# EAGLE schematic comunicazione seriale (EAGLE 8.0.0)
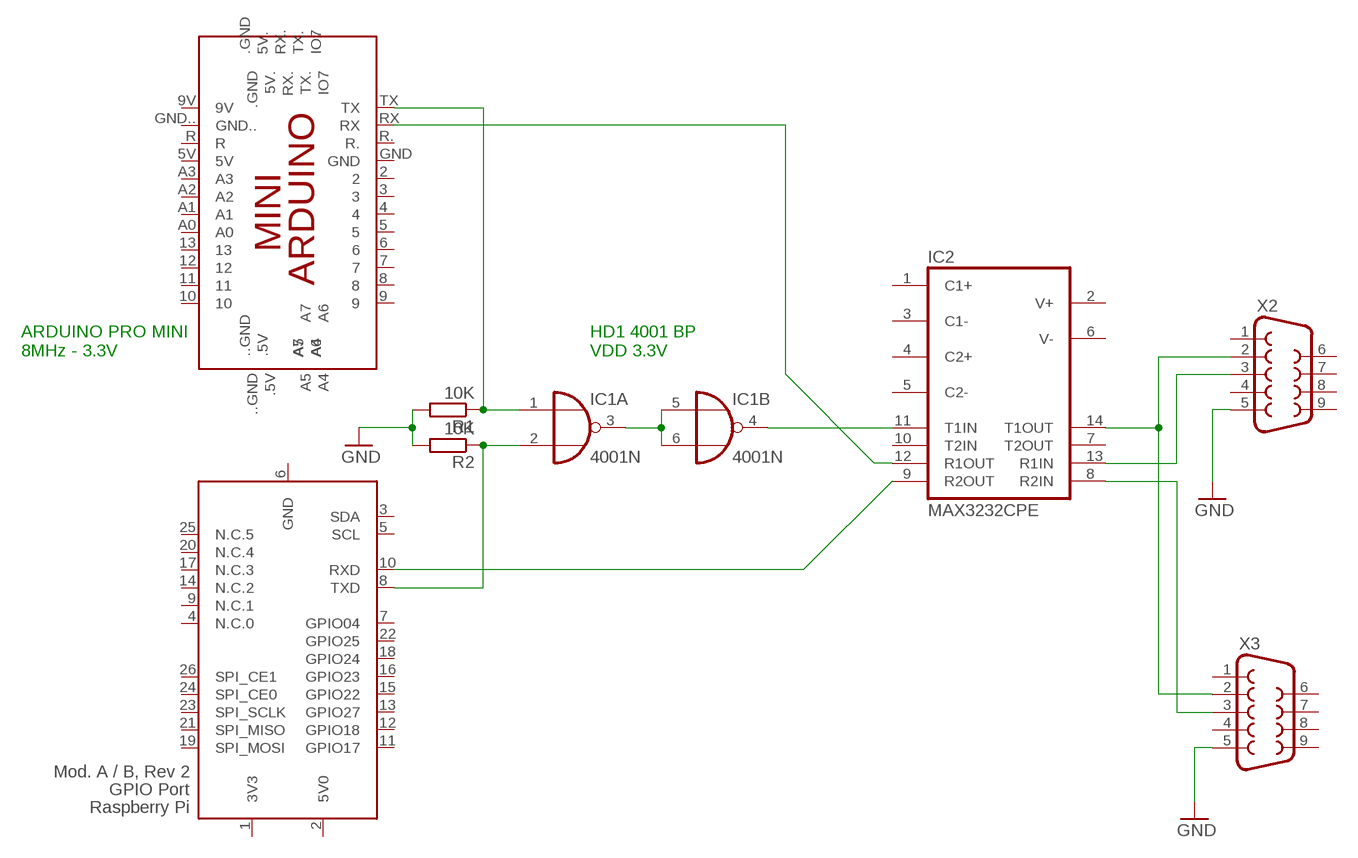
[diagram p0: schematic, sheet 1]

## Parts
IC1  4001N  [DIL14]
IC2  MAX3232CPE  [DIL16]
PCB1  ARDUINO_MINI  [ARDUINO_MINI]
R1  10K  R-EU_0207/10  [0207/10]
R2  10K  R-EU_0207/10  [0207/10]
X1  RASPI_BOARD_AB_F  [RASPI_BOARD_AB_FULL]
X2  F09H  [F09H]
X3  F09H  [F09H]

## Nets
GND: R1.2 R2.2 X2.5 X3.5
N$1: IC2.14(T1OUT) X2.2 X3.2
N$2: IC2.13(R1IN) X2.3
N$3: IC2.8(R2IN) X3.3
N$4: IC1.1(A:I0) PCB1.TX R1.1
N$5: IC1.2(A:I1) R2.1 X1.8(TXD)
N$6: IC1.3(A:O) IC1.5(B:I0) IC1.6(B:I1)
N$7: IC1.4(B:O) IC2.11(T1IN)
N$8: IC2.12(R1OUT) PCB1.RX
N$9: IC2.9(R2OUT) X1.10(RXD)
Unconnected: IC1.8(C:I0) IC1.9(C:I1) IC1.10(C:O) IC1.11(D:O) IC1.12(D:I0) IC1.13(D:I1) IC2.1(C1+) IC2.2(V+) IC2.3(C1-) IC2.4(C2+) IC2.5(C2-) IC2.6(V-) IC2.7(T2OUT) IC2.10(T2IN) PCB1.2 PCB1.3 PCB1.4 PCB1.5 PCB1.5V PCB1.5V. PCB1.6 PCB1.7 PCB1.8 PCB1.9 PCB1.9V PCB1.10 PCB1.11 PCB1.12 PCB1.13 PCB1..5V PCB1...GND PCB1..GND PCB1.A0 PCB1.A1 PCB1.A2 PCB1.A3 PCB1.A4 PCB1.A5 PCB1.A6 PCB1.A7 PCB1.GND PCB1.GND.. PCB1.IO7 PCB1.R PCB1.R. PCB1.RX. PCB1.TX. X1.3(SDA) X1.4(N.C.0) X1.5(SCL) X1.7(GPIO04) X1.9(N.C.1) X1.11(GPIO17) X1.12(GPIO18) X1.13(GPIO27) X1.14(N.C.2) X1.15(GPIO22) X1.16(GPIO23) X1.17(N.C.3) X1.18(GPIO24) X1.19(SPI_MOSI) X1.20(N.C.4) X1.21(SPI_MISO) X1.22(GPIO25) X1.23(SPI_SCLK) X1.24(SPI_CE0) X1.25(N.C.5) X1.26(SPI_CE1) X2.1 X2.4 X2.6 X2.7 X2.8 X2.9 X3.1 X3.4 X3.6 X3.7 X3.8 X3.9

## Notes on the sheet
- ARDUINO PRO MINI
  8MHz - 3.3V
- HD1 4001 BP
  VDD 3.3V

## Power pins joined to a net without a drawn wire
3V3: X1.1(3V3)
5V0: X1.2(5V0)
GND: IC2.15(GND) X1.6(GND)
VCC: IC2.16(VCC)
VDD: IC1.14(P:VDD)
VSS: IC1.7(P:VSS)

## Library data of the parts
IC1 = 40xx:4001: Quad 2-input NOR
IC2 = maxim:MAX3232*: True RS-232 Transceivers 3.0V to 5.5V, Low-Power up to 1Mbps, Using Four 0.1µF External Capacitors Source: http://pdfserv.maxim-ic.com/en/ds/MAX3222-MAX3241.pdf; MF: MAXIM; MPN: MAX3232CPE+; OC_FARNELL: 9724494; OC_NEWARK: 68K4626
PCB1 = E14_Arduino_revC:ARDUINO_MINI: Device for representing an Arduino Mini board with a footprint in an EAGLE design. Created by Dave Young for Element14. More EAGLE documentation at: http://www.element14.com/community/community/knode/cadsoft_eagle
R1 R2 = rcl:R-EU_: RESISTOR, European symbol
X1 = raspberrypi_bastelstube_v13:RASPI_BOARD_AB: Raspberry Pi GPIO connector with markings for the outer dimensions of the Raspberry Pi board model A or B with different sets of drill holes or mounting pads for model B Revision 2.0
X2 X3 = con-subd:F09: SUB-D; OC_FARNELL: unknown; OC_NEWARK: unknown